# Altium schematic sheet Mo_rong.SchDoc
size A
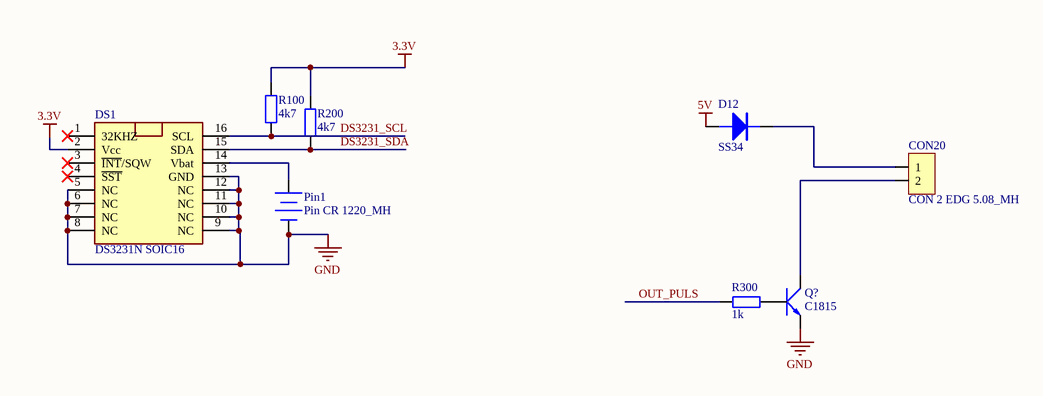
[diagram p0: Mo_rong.SchDoc]

## Parts
CON20  CON 2 EDG 5.08_MH  [CON 2 EDG 5.08]
D12  SS34  [SOD80]
DS1  DS3231N SOIC16  [SOIC16]
Pin1  Pin CR 1220_MH  [CR1220_MH]
Q?  C1815  [SOT23]
R100  4k7  [Tro SMD 0805]
R200  4k7  [Tro SMD 0805]
R300  1k  [Tro SMD 0805]

## Nets
3.3V: DS1.2(Vcc) R100.1 R200.1
5V: D12.1
GND: DS1.5(NC) DS1.6(NC) DS1.7(NC) DS1.8(NC) DS1.9(NC) DS1.10(NC) DS1.11(NC) DS1.12(NC) DS1.13(GND) Pin1.2(-) Q?.2(E)
DS3231_SCL: DS1.16(SCL) R100.2
DS3231_SDA: DS1.15(SDA) R200.2
OUT_PULS: R300.1
NetCON20_1: CON20.1 D12.2
NetCON20_2: CON20.2 Q?.3(C)
NetDS1_14: DS1.14(Vbat) Pin1.1(+)
NetQ?_1: Q?.1(B) R300.2

Not connected (* = marked no-connect by the designer): DS1 1(32KHZ)* 3(~{INT}/SQW)* 4(~{SST})*

## Library data of the parts
CON20 = CON 2 EDG 5.08_MH: CON 2 EDG 5.08 (xanh cong)
D12 = Diode 1N4148 SOD80 450mA 100V ( LL34 1N4148 SMD)_MH: Diode 1N4148 SOD80 450mA 100V ( LL34 1N4148 SMD)
Pin1 = Pin CR 1220_MH: cr1220
Q? = C1815 SOT23 TRANS NPN 0.15A 50V (SMD-HF)_MH
R100 R200 R300 = TRO_SMD_0805_MH: TRO_SMD_0805